# EasyEDA Pro project USB_HUB.epro

# Schematic Schematic1
Board Name: Board1; Create Date: 2026-03-28; Page Name: P1; Project Name: usb_hub; Schematic Name: Schematic1; Update Date: 2026-04-04; Company: EasyEDA.com; Page Size: A4; Version: V1.0
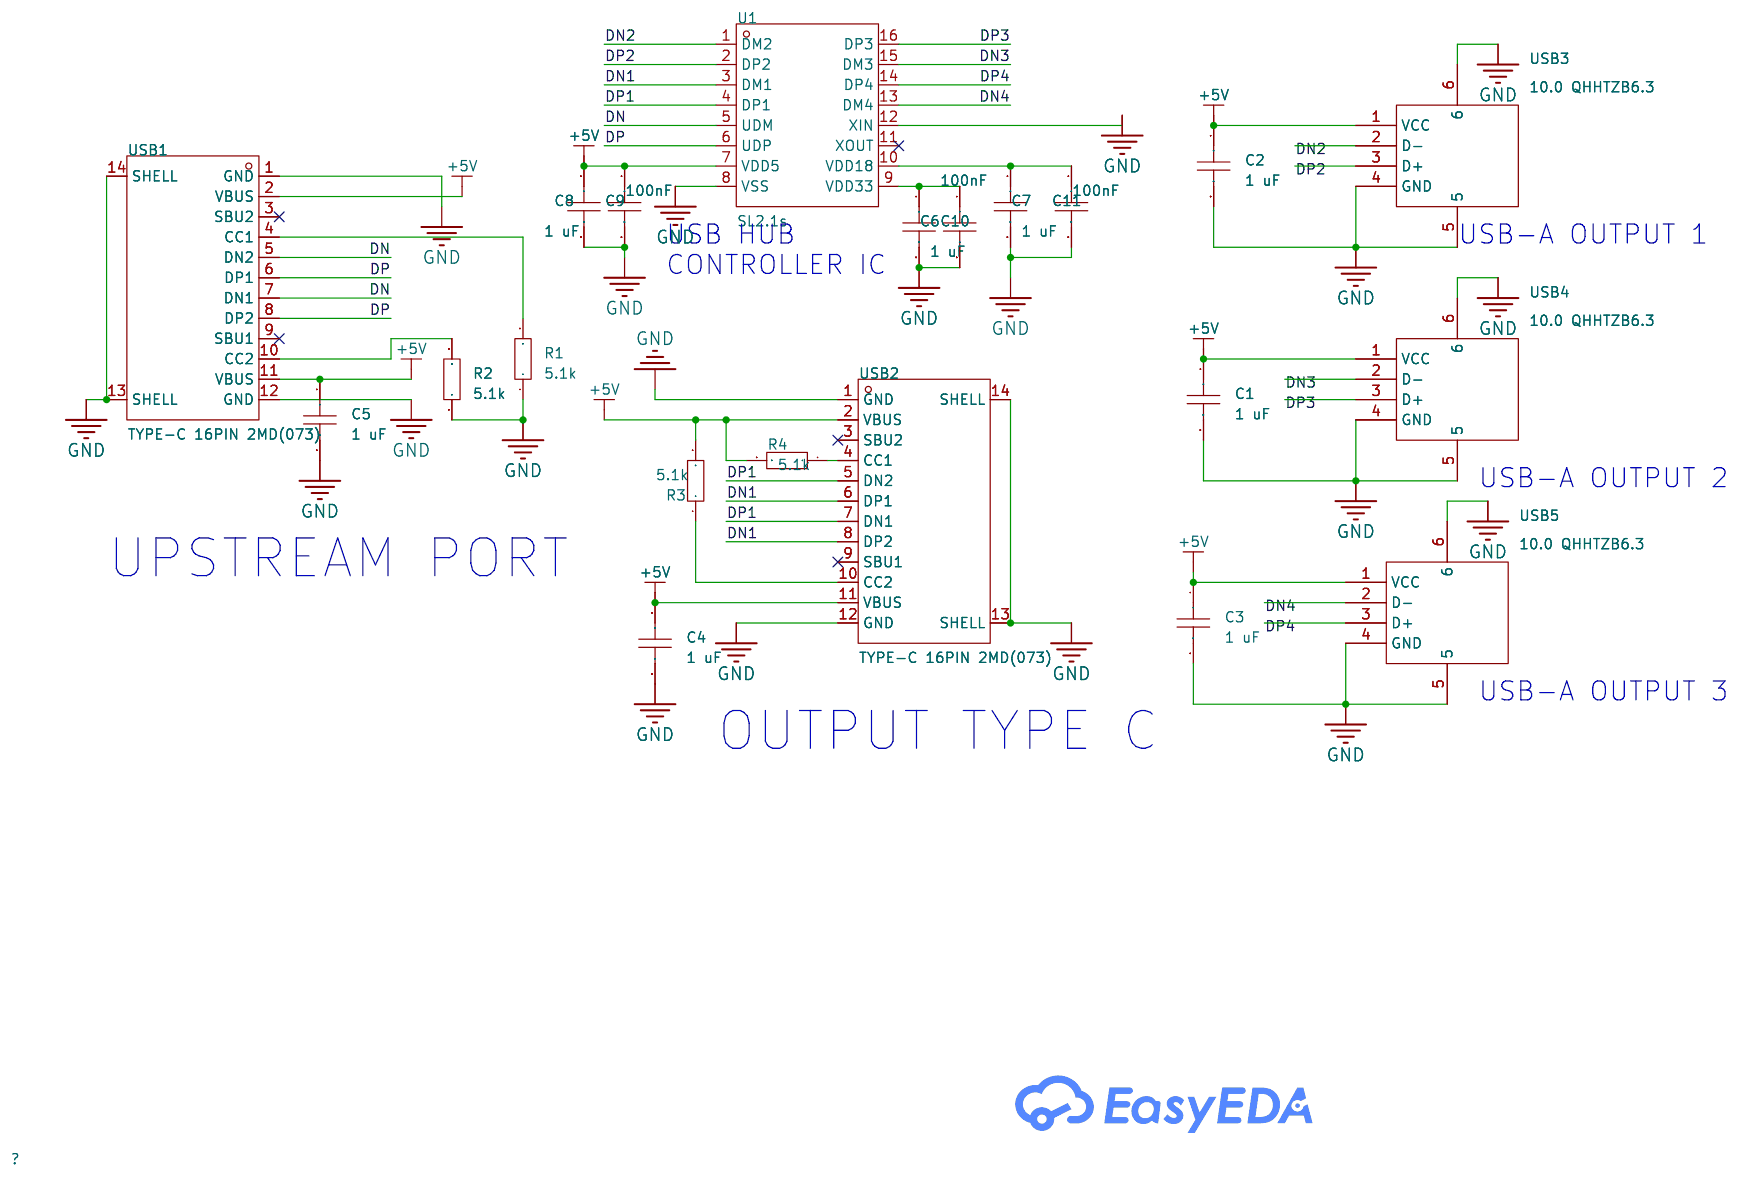
[diagram p0: schematic sheet]

## Parts
C1  1 uF  [C0603]
C2  1 uF  [C0603]
C3  1 uF  [C0603]
C4  1 uF  [C0603]
C5  1 uF  [C0603]
C6  1 uF  [C0603]
C7  1 uF  [C0603]
C8  1 uF  [C0603]
C9  100nF  [C0603]
C10  100nF  [C0603]
C11  100nF  [C0603]
R1  5.1k  [R0603]
R2  5.1k  [R0603]
R3  5.1k  [R0603]
R4  5.1k  [R0603]
U1  SL2.1s  [SSOP-16_L4.6-W2.6-P0.53-LS4.0-BL]
USB1  TYPE-C 16PIN 2MD(073)  [USB-C-SMD_TYPE-C-6PIN-2MD-073]
USB2  TYPE-C 16PIN 2MD(073)  [USB-C-SMD_TYPE-C-6PIN-2MD-073]
USB3  10.0 QHHTZB6.3  [USB-A-TH_10.0QHHTZB6.3]
USB4  10.0 QHHTZB6.3  [USB-A-TH_10.0QHHTZB6.3]
USB5  10.0 QHHTZB6.3  [USB-A-TH_10.0QHHTZB6.3]

## Library data of the parts
C1-C11 = CAP_0603: Supplier Footprint: 0603
R1-R4 = Res_0603: Supplier Footprint: 0603
U1 = SL2.1s: type:Hub USB Protocol:USB 2.0 Voltage - Supply:4V~5.25V Voltage - Supply:4V~5.25V Operating Temperature:0℃~+70℃ Operating Temperature:0℃~+70℃ Current - Supply:120mA Quiescent Supply Current:2.5mA Number of Channels:4; LCSC Part Name: USB2.0 HUB控制器集成电路; Supplier Part: C2684433; Manufacturer: CoreChips(和芯润德); Supplier Footprint: SSOP-16; JLCPCB Part Class: Extended Part; Datasheet: https://item.szlcsc.com/datasheet/SL2.1s/2782346.html; Supplier: LCSC; type: Hub; USB Protocol: USB 2.0; Voltage - Supply: 4V~5.25V; Operating Temperature: 0℃~+70℃; Current - Supply: 120mA; Quiescent Supply Current: 2.5mA; Number of Channels: 4
USB1 USB2 = TYPE-C 16PIN 2MD(073): Connector Type:Type-C Protocol Standard:- Gender:Female Mounting Type:Surface Mount, Right Angle Number of Contacts:16P Number of Ports:1 Current Rating-Power:3A Voltage Rating:5V Connect-Disconnect Life:10,000 Cycles Supplementary Features:- Center Heigh; LCSC Part Name: Type-C 母 卧贴; Supplier Part: C2765186; Manufacturer: SHOU HAN(首韩); Supplier Footprint: SMD; JLCPCB Part Class: Extended Part; Datasheet: https://item.szlcsc.com/datasheet/TYPE-C%252016PIN%25202MD(073)/2901843.html; Supplier: LCSC; Connector Type: Type-C; Gender: Female; Mounting Type: Surface Mount, Right Angle; Number of Contacts: 16P; Number of Ports: 1; Current Rating-Power: 3A; Voltage Rating: 5V; Connect-Disconnect Life: 10,000 Cycles; Detection color: Black; Operating Temperature: -25℃~+85℃
USB3-USB5 = 10.0 QHHTZB6.3: Connector Type:Type-A Protocol Standard:USB 2.0 Gender:Female Mounting Type:Surface Mount, Right Angle Number of Contacts:4P Number of Ports:1 Current Rating-Power:1.5A Voltage Rating:30V Connect-Disconnect Life:5,000 times Supplementary Features:- Center; LCSC Part Name: 壳长10.0mm; Supplier Part: C668591; Manufacturer: SHOU HAN(首韩); Supplier Footprint: SMD; JLCPCB Part Class: Extended Part; Datasheet: https://item.szlcsc.com/datasheet/10.0%2520QHHTZB6.3/698534.html; Supplier: LCSC; Connector Type: Type-A; Protocol Standard: USB 2.0; Gender: Female; Mounting Type: Surface Mount, Right Angle; Number of Contacts: 4P; Number of Ports: 1; Current Rating-Power: 1.5A; Voltage Rating: 30V; Connect-Disconnect Life: 5,000 times; Length: 10mm; Detection color: Black; Operating Temperature: -25℃~+85℃

## Nets
+5V: C1.1 C2.1 C3.1 C4.1 C5.1 C8.1 C9.1 R3.2 R4.2 U1.7(VDD5) USB1.2(VBUS) USB1.11(VBUS) USB2.2(VBUS) USB2.11(VBUS) USB3.1(VCC) USB4.1(VCC) USB5.1(VCC)
GND: C1.2 C2.2 C3.2 C4.2 C5.2 C6.2 C7.2 C8.2 C9.2 C10.2 C11.2 R1.1 R2.1 U1.8(VSS) U1.12(XIN) USB1.1(GND) USB1.12(GND) USB1.13(SHELL) USB1.14(SHELL) USB2.1(GND) USB2.12(GND) USB2.13(SHELL) USB2.14(SHELL) USB3.4(GND) USB3.5 USB3.6 USB4.4(GND) USB4.5 USB4.6 USB5.4(GND) USB5.5 USB5.6
DN: U1.5(UDM) USB1.5(DN2) USB1.7(DN1)
DN1: U1.3(DM1) USB2.6(DP1) USB2.8(DP2)
DN2: U1.1(DM2) USB3.2(D-)
DN3: U1.15(DM3) USB4.2(D-)
DN4: U1.13(DM4) USB5.2(D-)
DP: U1.6(UDP) USB1.6(DP1) USB1.8(DP2)
DP1: U1.4(DP1) USB2.5(DN2) USB2.7(DN1)
DP2: U1.2(DP2) USB3.3(D+)
DP3: U1.16(DP3) USB4.3(D+)
DP4: U1.14(DP4) USB5.3(D+)
$1N843: R2.2 USB1.10(CC2)
$1N849: R1.2 USB1.4(CC1)
$1N1535: R3.1 USB2.10(CC2)
$1N1585: R4.1 USB2.4(CC1)
$1N1869: C6.1 C10.1 U1.9(VDD33)
$1N1897: C7.1 C11.1 U1.10(VDD18)

Not connected (* = marked no-connect by the designer): U1 11(XOUT)*; USB1 3(SBU2)* 9(SBU1)*; USB2 3(SBU2)* 9(SBU1)*

## Notes on the sheet
- USB-A OUTPUT 1
- USB HUB
  CONTROLLER IC
- USB-A OUTPUT 2
- UPSTREAM PORT
- USB-A OUTPUT 3
- OUTPUT TYPE C

# Board PCB1
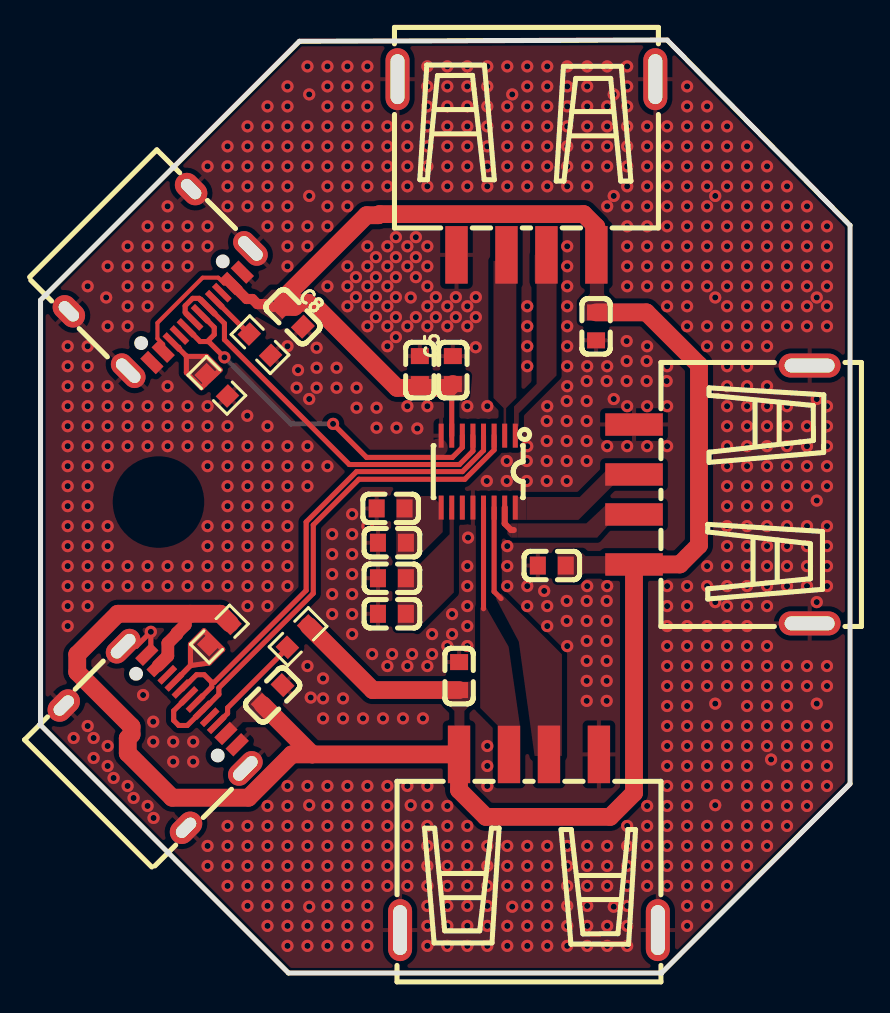
[diagram p1: board, top side]
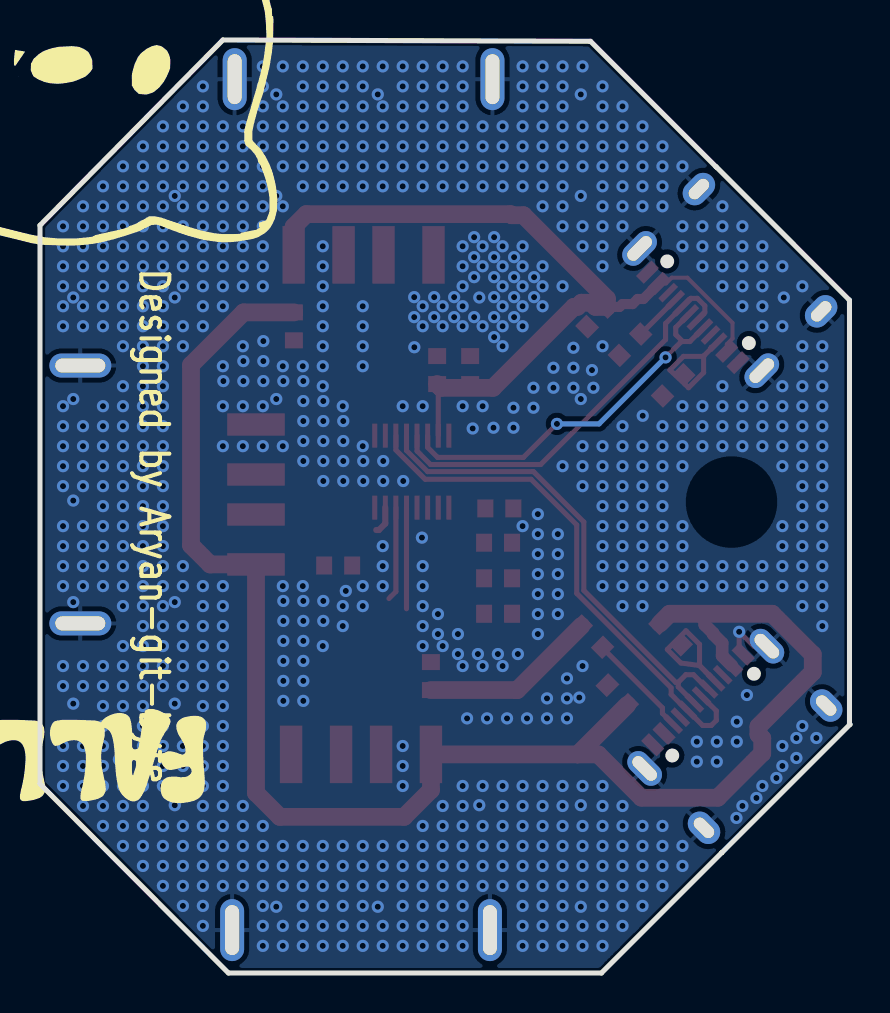
[diagram p2: board, bottom side, seen from below]

Outline 40.54 x 46.68 mm; copper layers: Top Layer, Bottom Layer. Coordinates in mm from the lower left corner of the outline.
Outline path: 0,12.44 6.41,6.02 6.42,6.02 12.44,0 31.11,0 40.54,9.46 40.54,37.4 31.38,46.68 12.99,46.61 6.7,40.33 6.69,40.33 0.03,33.66 0.03,12.47 0,12.44
Stack: Top Layer 0.035mm / Dielectric1 1.51mm FR4 er 4.5 / Bottom Layer 0.035mm

## Design rules (mm)
template: JLCPCB Capability(Two Layers Board)
spacing copperThickness1oz (default): track to track 0.102, other pairs 0.152 to 0.3
spacing copperThickness2oz: track to track 0.203, other pairs 0.152 to 0.3
track width copperThickness1oz (default): min 0.127, default 0.254, max 2.54
track width copperThickness2oz: min 0.203, default 0.254, max 2.54
differential pair differentialPair (default): width min 0.127, default 0.254, max 2.54; gap min 0.152, default 0.152
via viaSize (default): diameter min 0.5, default 0.61, max 10; hole min 0.3, default 0.305, max 6.3

## Placement (name value [footprint] x y rotation side)
C1  1 uF  [C0603]  20.97 14.86 90 top
C2  1 uF  [C0603]  27.83 32.35 270 top
C3  1 uF  [C0603]  25.62 20.39 180 top
C4  1 uF  [C0603]  11.65 13.91 45 top
C5  1 uF  [C0603]  19.01 30.16 90 top
C6  1 uF  [C0603]  17.55 23.24 180 top
C7  1 uF  [C0603]  17.61 19.75 180 top
C8  1 uF  [C0603]  12.66 32.83 315 top
C9  100nF  [C0603]  20.66 30.16 90 top
C10  100nF  [C0603]  17.61 21.53 180 top
C11  100nF  [C0603]  17.61 17.97 180 top
R1  5.1k  [R0603]  11.01 31.43 135 top
R2  5.1k  [R0603]  8.85 29.4 135 top
R3  5.1k  [R0603]  12.91 16.83 45 top
R4  5.1k  [R0603]  8.98 16.96 45 top
U1  SL2.1s  [SSOP-16_L4.6-W2.6-P0.53-LS4.0-BL]  21.93 25.08 180 top
USB1  TYPE-C 16PIN 2MD(073)  [USB-C-SMD_TYPE-C-6PIN-2MD-073]  6.18 34.48 225 top
USB2  TYPE-C 16PIN 2MD(073)  [USB-C-SMD_TYPE-C-6PIN-2MD-073]  5.93 12 315 top
USB3  10.0 QHHTZB6.3  [USB-A-TH_10.0QHHTZB6.3]  24.34 40.32 180 top
USB4  10.0 QHHTZB6.3  [USB-A-TH_10.0QHHTZB6.3]  34.12 23.94 90 top
USB5  10.0 QHHTZB6.3  [USB-A-TH_10.0QHHTZB6.3]  24.47 6.54 0 top

## Footprints (pads in the part's own frame, mm; a bottom-side part is the same pattern mirrored in y, then rotated)
C0603
  rect 0.8x0.9 smd: 1(-0.7,0) 2(0.7,0)
R0603
  rect 0.806x0.864 smd: 1(-0.753,0) 2(0.753,0)
SSOP-16_L4.6-W2.6-P0.53-LS4.0-BL
  rect 0.25x1.2 smd: 1(-1.855,-1.8) 2(-1.325,-1.8) 3(-0.795,-1.8) 4(-0.265,-1.8) 5(0.265,-1.8) 6(0.795,-1.8) 7(1.325,-1.8) 8(1.855,-1.8) 9(1.855,1.8) 10(1.325,1.8) 11(0.795,1.8) 12(0.265,1.8) 13(-0.265,1.8) 14(-0.795,1.8) 15(-1.325,1.8) 16(-1.855,1.8)
USB-A-TH_10.0QHHTZB6.3
  rect 1.12x2.88 smd: 1(-3.5,4.395) 2(-1,4.395) 3(1,4.395) 4(3.5,4.395)
  oval 1.2x3.1 hole 0.7x2.5: 5(-6.45,-4.395) 6(6.45,-4.395)
USB-C-SMD_TYPE-C-6PIN-2MD-073
  rect 0.55x1.1 smd: 1(-3.2,2.375) 2(-2.4,2.375) 11(2.4,2.375) 12(3.2,2.375)
  rect 0.3x1.1 smd: 3(-1.75,2.375) 4(-1.25,2.375) 5(-0.75,2.375) 6(-0.25,2.375) 7(0.25,2.375) 8(0.75,2.375) 9(1.25,2.375) 10(1.75,2.375)
  oval 1.1x2 hole 0.6x1.5: 13(-4.325,1.825) 14(4.325,1.825)
  oval 1.2x1.8 hole 0.6x1.2: 13(-4.325,-2.375) 14(4.325,-2.375)

## Nets
As in the schematic.

Pads without a net: U1 11; USB1 3 9; USB2 3 9

## Via types
v1: diameter 0.61, hole 0.305, Top Layer to Bottom Layer, 927 vias

## Routing (per net, layer and track width the routed paths; a pad name or vN(x,y) marks a point on that pad's centre or on a via; arc(x,y) is an arc through that point)
+5V: length 132.6
  Top Layer w0.2: USB1.2 9.21,34.5 8.92,34.79 8.14,34.79 5.88,32.53 5.88,31.74 6.17,31.46 6.17,31.11
  Top Layer w0.254: U1.7 20.61,29.41
  Top Layer w0.508: 12.17,33.33 11.53,33.33 11.39,33.47 10.88,33.47 10.63,33.72 10.34,33.72 USB1.2
  Top Layer w0.635: USB2.2 6.4,15.87 6.4,16.5 6.85,16.95 6.85,17 7.27,17.42 7.27,17.72 7.53,17.97
  Top Layer w0.889: C1.1 16.65,14.16 R3.2 ; R4.2 9.03,17.97 3.9,17.97 1.87,15.94 1.87,15.05 4.58,12.33 4.58,11.93 4.39,11.74 4.39,10.99 6.62,8.77 10.44,8.77 12.6,10.94 13.63,10.94 ; 13.63,10.94 USB5.1 20.97,9.15 22.31,7.81 28.54,7.81 29.73,9.01 USB4.1 32.02,20.44 32.98,21.4 32.98,30.42 30.35,33.05 C2.1 ; 13.63,10.94 11.15,13.41 ; C9.1 20.47,29.28 17.87,29.28 13.82,33.33 13.65,33.33 13.44,33.53 12.94,33.53 12.74,33.33 12.17,33.33 12.17,33.73 16.34,37.91 16.93,37.91 16.99,37.97 27.21,37.97 27.84,37.33 USB3.1
GND: length 2.9
  Top Layer w0.254: 5.35,15.95 5.43,15.95 5.55,16.07 v1(5.55,17.07) 4.83,16.35 USB2.13
  vias: v1(1.39,31.36) v1(1.39,30.36) v1(1.39,29.36) v1(1.39,28.36) v1(1.39,27.36) v1(1.39,26.36) v1(1.39,25.36) v1(1.39,24.36) v1(1.39,23.36) v1(1.39,22.36) v1(1.39,21.36) v1(1.39,20.36) v1(1.39,19.36) v1(1.39,18.36) v1(1.39,17.36) v1(1.69,11.76) v1(2.39,34.36) v1(2.39,31.36) v1(2.39,30.36) v1(2.39,29.36) v1(2.39,28.36) v1(2.39,27.36) v1(2.39,26.36) v1(2.39,25.36) v1(2.39,24.36) v1(2.39,23.36) v1(2.39,22.36) v1(2.39,21.36) v1(2.39,20.36) v1(2.39,19.36) v1(2.39,18.36) v1(2.39,12.36) v1(2.69,11.76) v1(2.69,10.76) v1(3.31,33.8) v1(3.39,35.36) v1(3.39,32.36) v1(3.39,29.36) v1(3.39,28.36) v1(3.39,27.36) v1(3.39,26.36) v1(3.39,25.36) v1(3.39,22.36) v1(3.39,21.36) v1(3.39,20.36) v1(3.39,19.36) v1(3.39,11.36) v1(3.39,10.36) v1(3.69,9.76) v1(4.39,36.36) v1(4.39,35.36) v1(4.39,34.36) v1(4.39,33.36) v1(4.39,32.36) v1(4.39,28.36) v1(4.39,27.36) v1(4.39,26.36) v1(4.39,20.36) v1(4.39,19.36) v1(4.39,9.36) v1(4.69,8.76) v1(5.16,13.91) v1(5.39,37.36) v1(5.39,36.36) v1(5.39,35.36) v1(5.39,34.36) v1(5.39,33.36) v1(5.39,28.36) v1(5.39,27.36) v1(5.39,26.36) v1(5.39,20.36) v1(5.39,19.36) v1(5.39,8.36) v1(5.67,12.57) v1(5.67,11.57) v1(5.69,7.76) v1(6.39,38.36) v1(6.39,37.36) v1(6.39,36.36) v1(6.39,35.36) v1(6.39,34.36) v1(6.39,29.36) v1(6.39,28.36) v1(6.39,27.36) v1(6.39,26.36) v1(6.39,20.36) v1(6.39,19.36) v1(6.67,11.57) v1(6.67,10.57) v1(7.39,37.36) v1(7.39,36.36) v1(7.39,35.36) v1(7.39,28.36) v1(7.39,27.36) v1(7.39,26.36) v1(7.39,20.36) v1(7.39,19.36) v1(7.67,11.57) v1(7.67,10.57) v1(8.39,40.36) v1(8.39,37.36) v1(8.39,36.36) v1(8.39,28.36) v1(8.39,27.36) v1(8.39,26.36) v1(8.39,25.36) v1(8.39,22.36) v1(8.39,21.36) v1(8.39,20.36) v1(8.39,19.36) v1(8.39,6.36) v1(8.39,5.36) v1(9.39,41.36) v1(9.39,40.36) v1(9.39,39.36) v1(9.39,38.36) v1(9.39,27.36) v1(9.39,26.36) v1(9.39,25.36) v1(9.39,24.36) v1(9.39,23.36) v1(9.39,22.36) v1(9.39,21.36) v1(9.39,20.36) v1(9.39,19.36) v1(9.39,7.36) v1(9.39,6.36) v1(9.39,5.36) v1(9.39,4.36) v1(10.39,42.36) v1(10.39,41.36) v1(10.39,40.36) v1(10.39,39.36) v1(10.39,38.36) v1(10.38,27.88) v1(10.39,26.36) v1(10.39,25.36) v1(10.39,24.36) v1(10.39,23.36) v1(10.39,22.36) v1(10.39,21.36) v1(10.39,20.36) v1(10.39,19.36) v1(10.39,18.36) v1(10.39,7.36) v1(10.39,6.36) v1(10.39,5.36) v1(10.39,4.36) v1(10.39,3.36) v1(11.39,43.36) v1(11.39,42.36) v1(11.39,41.36) v1(11.39,40.36) v1(11.39,39.36) v1(11.39,38.36) v1(11.39,37.36) v1(11.39,27.36) v1(11.39,26.36) v1(11.39,25.36) v1(11.39,24.36) v1(11.39,23.36) v1(11.39,22.36) v1(11.39,21.36) v1(11.39,20.36) v1(11.39,19.36) v1(11.39,18.36) v1(11.39,8.36) v1(11.39,7.36) v1(11.39,6.36) v1(11.39,5.36) v1(11.39,4.36) v1(11.39,3.36) v1(11.39,2.36) v1(12.39,44.36) v1(12.39,43.36) v1(12.39,42.36) v1(12.39,41.36) v1(12.39,40.36) v1(12.39,39.36) v1(12.39,38.36) v1(12.39,37.36) v1(12.39,36.36) v1(12.39,35.36) v1(12.39,31.36) v1(12.39,26.36) v1(12.39,25.36) v1(12.39,24.36) v1(12.39,23.36) v1(12.39,22.36) v1(12.39,21.36) v1(12.39,20.36) v1(12.39,19.36) v1(12.39,9.36) v1(12.39,8.36) v1(12.39,7.36) v1(12.39,6.36) v1(12.39,5.36) v1(12.39,4.36) v1(12.39,3.36) v1(12.39,2.36) v1(12.39,1.36) v1(12.84,29.28) v1(12.91,30.16) v1(13.39,45.36) v1(13.39,42.36) v1(13.39,41.36) v1(13.39,40.36) v1(13.39,37.36) v1(13.39,36.36) v1(13.39,26.36) v1(13.39,25.36) v1(13.39,24.36) v1(13.39,15.36) v1(13.39,9.36) v1(13.39,7.36) v1(13.39,6.36) v1(13.39,5.36) v1(13.39,4.36) v1(13.39,2.36) v1(13.39,1.36) v1(13.47,43.96) v1(13.47,38.88) v1(13.47,28.72) v1(13.55,13.78) v1(13.47,8.4) v1(13.47,3.32) v1(13.84,31.28) v1(13.84,30.28) v1(13.84,29.28) v1(14.17,14.74) v1(14.17,13.74) v1(14.17,12.74) v1(14.39,45.36) v1(14.39,44.36) v1(14.39,43.36) v1(14.39,42.36) v1(14.39,41.36) v1(14.39,40.36) v1(14.39,39.36) v1(14.39,38.36) v1(14.39,37.36) v1(14.39,34.36) v1(14.39,25.36) v1(14.39,9.36) v1(14.39,8.36) v1(14.39,7.36) v1(14.39,6.36) v1(14.39,5.36) v1(14.39,4.36) v1(14.39,3.36) v1(14.39,2.36) v1(14.39,1.36) v1(14.62,21.96) v1(14.62,20.96) v1(14.62,19.96) v1(14.62,18.96) v1(14.62,17.96) v1(14.84,30.28) v1(14.84,29.28) v1(15.17,13.74) v1(15.17,12.74) v1(15.39,45.36) v1(15.39,44.36) v1(15.39,43.36) v1(15.39,42.36) v1(15.39,41.36) v1(15.39,40.36) v1(15.39,39.36) v1(15.39,38.36) v1(15.39,35.36) v1(15.39,34.36) v1(15.39,33.36) v1(15.39,9.36) v1(15.39,8.36) v1(15.39,7.36) v1(15.39,6.36) v1(15.39,5.36) v1(15.39,4.36) v1(15.39,3.36) v1(15.39,2.36) v1(15.39,1.36) v1(15.62,22.96) v1(15.62,21.96) v1(15.62,20.96) v1(15.62,19.96) v1(15.62,18.96) v1(15.62,17.96) v1(15.62,16.96) v1(15.81,34.81) v1(15.81,33.81) v1(15.84,29.28) v1(15.84,28.28) v1(16.17,12.74) v1(16.39,45.36) v1(16.39,44.36) v1(16.39,43.36) v1(16.39,42.36) v1(16.39,41.36) v1(16.39,40.36) v1(16.39,39.36) v1(16.39,36.36) v1(16.39,35.36) v1(16.39,34.36) v1(16.39,33.36) v1(16.39,32.36) v1(16.39,22.36) v1(16.39,9.36) v1(16.39,8.36) v1(16.39,7.36) v1(16.39,6.36) v1(16.39,5.36) v1(16.39,4.36) v1(16.39,3.36) v1(16.39,2.36) v1(16.39,1.36) v1(16.62,15.96) v1(16.81,35.81) v1(16.81,34.81) v1(16.81,33.81) v1(16.81,32.81) v1(16.84,28.28) v1(16.84,27.28) v1(17.17,12.74) v1(17.39,42.36) v1(17.39,41.36) v1(17.39,40.36) v1(17.39,39.36) v1(17.39,36.36) v1(17.39,35.36) v1(17.39,34.36) v1(17.39,33.36) v1(17.39,32.36) v1(17.39,31.36) v1(17.39,15.36) v1(17.39,9.36) v1(17.39,8.36) v1(17.39,7.36) v1(17.39,6.36) v1(17.39,5.36) v1(17.39,4.36) v1(17.62,15.96) v1(17.81,36.81) v1(17.81,35.81) v1(17.81,34.81) v1(17.81,33.81) v1(17.81,32.81) v1(17.81,31.81) v1(17.84,27.28) v1(18.17,12.74) v1(18.39,42.36) v1(18.39,41.36) v1(18.39,40.36) v1(18.39,39.36) v1(18.39,36.36) v1(18.39,35.36) v1(18.39,32.36) v1(18.39,28.36) v1(18.39,15.36) v1(18.39,9.36) v1(18.39,7.36) v1(18.39,6.36) v1(18.39,5.36) v1(18.39,4.36) v1(18.55,33.8) v1(18.62,15.96) v1(18.55,8.4) v1(18.81,36.81) v1(18.81,35.81) v1(18.81,34.81) v1(18.81,32.81) v1(18.88,27.24) v1(19.17,12.74) v1(19.39,45.36) v1(19.39,44.36) v1(19.39,43.36) v1(19.39,42.36) v1(19.39,41.36) v1(19.39,40.36) v1(19.39,39.36) v1(19.39,36.36) v1(19.39,35.36) v1(19.39,34.36) v1(19.39,33.36) v1(19.39,32.36) v1(19.39,28.36) v1(19.39,15.36) v1(19.39,9.36) v1(19.39,8.36) v1(19.39,7.36) v1(19.39,6.36) v1(19.39,5.36) v1(19.39,4.36) v1(19.39,3.36) v1(19.39,2.36) v1(19.39,1.36) v1(19.62,16.96) v1(19.62,15.96) v1(19.81,33.81) v1(19.81,32.81) v1(20.39,45.36) v1(20.39,44.36) v1(20.39,43.36) v1(20.39,42.36) v1(20.39,41.36) v1(20.39,40.36) v1(20.39,39.36) v1(20.39,33.36) v1(20.39,32.36) v1(20.39,16.36) v1(20.39,8.36) v1(20.39,7.36) v1(20.39,6.36) v1(20.39,5.36) v1(20.39,4.36) v1(20.39,3.36) v1(20.39,2.36) v1(20.39,1.36) v1(20.62,17.96) v1(20.62,16.96) v1(20.81,33.81) v1(20.81,32.81) v1(21.39,45.36) v1(21.39,44.36) v1(21.39,43.36) v1(21.39,42.36) v1(21.39,41.36) v1(21.39,40.36) v1(21.39,39.36) v1(21.39,33.36) v1(21.39,32.36) v1(21.39,28.36) v1(21.42,21.78) v1(21.39,20.36) v1(21.39,19.36) v1(21.39,18.36) v1(21.39,17.36) v1(21.39,16.36) v1(21.39,7.36) v1(21.39,6.36) v1(21.39,5.36) v1(21.39,4.36) v1(21.39,3.36) v1(21.39,2.36) v1(21.39,1.36) v1(21.81,33.81) v1(21.81,32.81) v1(21.81,31.31) v1(22.39,45.36) v1(22.39,44.36) v1(22.39,43.36) v1(22.39,42.36) v1(22.39,41.36) v1(22.39,40.36) v1(22.39,39.36) v1(22.39,28.36) v1(22.36,24.61) v1(22.39,11.36) v1(22.39,10.36) v1(22.39,9.36) v1(22.39,6.36) v1(22.39,5.36) v1(22.39,4.36) v1(22.39,3.36) v1(22.39,2.36) v1(22.39,1.36) v1(23.39,45.36) v1(23.39,43.36) v1(23.39,42.36) v1(23.39,41.36) v1(23.39,40.36) v1(23.39,39.36) v1(23.36,25.61) v1(23.36,24.61) v1(23.39,21.36) v1(23.39,20.36) v1(23.39,19.36) v1(23.39,6.36) v1(23.39,5.36) v1(23.39,4.36) v1(23.39,2.36) v1(23.39,1.36) v1(23.63,43.96) v1(23.63,3.32) v1(24.39,45.36) v1(24.39,44.36) v1(24.39,43.36) v1(24.39,42.36) v1(24.39,41.36) v1(24.39,40.36) v1(24.39,39.36) v1(24.39,33.36) v1(24.39,32.36) v1(24.39,31.36) v1(24.39,30.36) v1(24.39,26.36) v1(24.36,25.61) v1(24.36,24.61) v1(24.39,19.36) v1(24.39,18.36) v1(24.39,6.36) v1(24.39,5.36) v1(24.39,4.36) v1(24.39,3.36) v1(24.39,2.36) v1(24.39,1.36) v1(25.23,19.12) v1(25.39,45.36) v1(25.39,44.36) v1(25.39,43.36) v1(25.39,42.36) v1(25.39,41.36) v1(25.39,40.36) v1(25.39,39.36) v1(25.39,28.36) v1(25.36,27.61) v1(25.36,26.61) v1(25.36,25.61) v1(25.36,24.61) v1(25.39,18.36) v1(25.39,17.36) v1(25.39,6.36) v1(25.39,5.36) v1(25.39,4.36) v1(25.39,3.36) v1(25.39,2.36) v1(25.39,1.36) v1(26.39,45.36) v1(26.39,44.36) v1(26.39,43.36) v1(26.39,42.36) v1(26.39,41.36) v1(26.39,40.36) v1(26.39,39.36) v1(26.39,36.36) v1(26.39,35.36) v1(26.39,34.36) v1(26.39,33.36) v1(26.39,32.36) v1(26.39,31.36) v1(26.39,30.36) v1(26.39,29.36) v1(26.36,28.61) v1(26.36,27.61) v1(26.36,26.61) v1(26.36,25.61) v1(26.36,24.61) v1(26.36,18.61) v1(26.36,17.61) v1(26.39,16.36) v1(26.39,6.36) v1(26.39,5.36) v1(26.39,4.36) v1(26.39,3.36) v1(26.39,2.36) v1(26.39,1.36) v1(27.39,45.36) v1(27.39,44.36) v1(27.39,43.36) v1(27.39,42.36) v1(27.39,41.36) v1(27.39,40.36) v1(27.39,39.36) v1(27.39,30.36) v1(27.36,29.61) v1(27.36,28.61) v1(27.36,27.61) v1(27.36,26.61) v1(27.36,25.61) v1(27.39,19.36) v1(27.36,18.61) v1(27.36,17.61) v1(27.36,16.61) v1(27.36,15.61) v1(27.36,14.61) v1(27.36,13.61) v1(27.39,6.36) v1(27.39,5.36) v1(27.39,4.36) v1(27.39,3.36) v1(27.39,2.36) v1(27.39,1.36) v1(28.39,45.36) v1(28.39,43.36) v1(28.39,42.36) v1(28.39,41.36) v1(28.39,40.36) v1(28.39,38.36) v1(28.39,30.36) v1(28.36,29.61) v1(28.39,26.36) v1(28.39,19.36) v1(28.36,18.61) v1(28.36,17.61) v1(28.36,16.61) v1(28.36,15.61) v1(28.36,14.61) v1(28.36,13.61) v1(28.39,6.36) v1(28.39,5.36) v1(28.39,4.36) v1(28.39,2.36) v1(28.39,1.36) v1(28.71,43.96) v1(28.71,38.88) v1(28.71,28.72) v1(28.71,3.32) v1(29.39,45.36) v1(29.39,44.36) v1(29.39,43.36) v1(29.39,42.36) v1(29.39,41.36) v1(29.39,40.36) v1(29.39,39.36) v1(29.39,38.36) v1(29.39,37.36) v1(29.39,36.36) v1(29.39,35.36) v1(29.39,34.36) v1(29.36,31.61) v1(29.36,30.61) v1(29.36,29.61) v1(29.39,28.36) v1(29.39,26.36) v1(29.39,7.36) v1(29.39,6.36) v1(29.39,5.36) v1(29.39,4.36) v1(29.39,3.36) v1(29.39,2.36) v1(29.39,1.36) v1(30.39,42.36) v1(30.39,41.36) v1(30.39,40.36) v1(30.39,39.36) v1(30.39,38.36) v1(30.39,37.36) v1(30.39,36.36) v1(30.39,35.36) v1(30.39,34.36) v1(30.39,31.36) v1(30.36,30.61) v1(30.36,29.61) v1(30.39,28.36) v1(30.39,26.36) v1(30.39,8.36) v1(30.39,7.36) v1(30.39,6.36) v1(30.39,5.36) v1(30.39,4.36) v1(31.39,42.36) v1(31.39,41.36) v1(31.39,40.36) v1(31.39,39.36) v1(31.39,38.36) v1(31.39,37.36) v1(31.39,36.36) v1(31.39,35.36) v1(31.39,34.36) v1(31.39,33.36) v1(31.39,30.36) v1(31.36,29.61) v1(31.39,28.36) v1(31.39,26.36) v1(31.39,19.36) v1(31.39,18.36) v1(31.39,17.36) v1(31.39,16.36) v1(31.39,15.36) v1(31.39,14.36) v1(31.39,13.36) v1(31.39,12.36) v1(31.39,11.36) v1(31.39,10.36) v1(31.39,9.36) v1(31.39,8.36) v1(31.39,7.36) v1(31.39,6.36) v1(31.39,5.36) v1(31.39,4.36) v1(32.39,44.36) v1(32.39,43.36) v1(32.39,42.36) v1(32.39,41.36) v1(32.39,40.36) v1(32.39,39.36) v1(32.39,38.36) v1(32.39,37.36) v1(32.39,36.36) v1(32.39,35.36) v1(32.39,34.36) v1(32.39,33.36) v1(32.39,32.36) v1(32.39,19.36) v1(32.39,18.36) v1(32.39,17.36) v1(32.39,16.36) v1(32.39,15.36) v1(32.39,14.36) v1(32.39,13.36) v1(32.39,12.36) v1(32.39,11.36) v1(32.39,10.36) v1(32.39,9.36) v1(32.39,8.36) v1(32.39,7.36) v1(32.39,6.36) v1(32.39,5.36) v1(32.39,4.36) v1(32.39,3.36) v1(32.39,2.36) v1(33.39,43.36) v1(33.39,42.36) v1(33.39,41.36) v1(33.39,40.36) v1(33.39,39.36) v1(33.39,38.36) v1(33.39,37.36) v1(33.39,36.36) v1(33.39,35.36) v1(33.39,34.36) v1(33.39,32.36) v1(33.39,31.36) v1(33.39,20.36) v1(33.39,19.36) v1(33.39,17.36) v1(33.39,16.36) v1(33.39,15.36) v1(33.39,14.36) v1(33.39,12.36) v1(33.39,11.36) v1(33.39,10.36) v1(33.39,9.36) v1(33.39,7.36) v1(33.39,6.36) v1(33.39,5.36) v1(33.39,4.36) v1(33.39,3.36) v1(33.79,38.88) v1(33.79,33.8) v1(33.79,18.56) v1(33.79,13.48) v1(33.79,8.4) v1(34.39,42.36) v1(34.39,41.36) v1(34.39,40.36) v1(34.39,39.36) v1(34.39,38.36) v1(34.39,37.36) v1(34.39,36.36) v1(34.39,35.36) v1(34.39,34.36) v1(34.39,33.36) v1(34.39,32.36) v1(34.39,31.36) v1(34.39,30.36) v1(34.39,29.36) v1(34.39,28.36) v1(34.39,27.36) v1(34.39,26.36) v1(34.39,25.36) v1(34.39,24.36) v1(34.39,23.36) v1(34.39,22.36) v1(34.39,21.36) v1(34.39,20.36) v1(34.39,19.36) v1(34.39,18.36) v1(34.39,17.36) v1(34.39,16.36) v1(34.39,15.36) v1(34.39,14.36) v1(34.39,12.36) v1(34.39,11.36) v1(34.39,10.36) v1(34.39,9.36) v1(34.39,7.36) v1(34.39,6.36) v1(34.39,5.36) v1(34.39,4.36) v1(35.39,41.36) v1(35.39,40.36) v1(35.39,39.36) v1(35.39,38.36) v1(35.39,37.36) v1(35.39,36.36) v1(35.39,35.36) v1(35.39,34.36) v1(35.39,33.36) v1(35.39,32.36) v1(35.39,31.36) v1(35.39,30.36) v1(35.39,29.36) v1(35.39,28.36) v1(35.39,27.36) v1(35.39,26.36) v1(35.39,25.36) v1(35.39,24.36) v1(35.39,23.36) v1(35.39,22.36) v1(35.39,21.36) v1(35.39,20.36) v1(35.39,19.36) v1(35.39,18.36) v1(35.39,17.36) v1(35.39,16.36) v1(35.39,15.36) v1(35.39,14.36) v1(35.39,13.36) v1(35.39,12.36) v1(35.39,11.36) v1(35.39,10.36) v1(35.39,9.36) v1(35.39,8.36) v1(35.39,7.36) v1(35.39,6.36) v1(35.39,5.36) v1(36.39,40.36) v1(36.39,39.36) v1(36.39,38.36) v1(36.39,37.36) v1(36.39,36.36) v1(36.39,35.36) v1(36.39,34.36) v1(36.39,33.36) v1(36.39,32.36) v1(36.39,31.36) v1(36.39,29.36) v1(36.39,28.36) v1(36.39,27.36) v1(36.39,26.36) v1(36.39,25.36) v1(36.39,24.36) v1(36.39,23.36) v1(36.39,22.36) v1(36.39,21.36) v1(36.39,20.36) v1(36.39,19.36) v1(36.39,18.36) v1(36.39,16.36) v1(36.39,15.36) v1(36.39,14.36) v1(36.39,13.36) v1(36.39,12.36) v1(36.39,11.36) v1(36.39,9.36) v1(36.39,8.36) v1(36.39,7.36) v1(36.39,6.36) v1(36.59,10.68) v1(37.39,39.36) v1(37.39,38.36) v1(37.39,37.36) v1(37.39,36.36) v1(37.39,35.36) v1(37.39,34.36) v1(37.39,33.36) v1(37.39,32.36) v1(37.39,28.36) v1(37.39,27.36) v1(37.39,26.36) v1(37.39,25.36) v1(37.39,24.36) v1(37.39,23.36) v1(37.39,22.36) v1(37.39,21.36) v1(37.39,20.36) v1(37.39,19.36) v1(37.39,15.36) v1(37.39,14.36) v1(37.39,13.36) v1(37.39,12.36) v1(37.39,11.36) v1(37.39,10.36) v1(37.39,9.36) v1(37.39,8.36) v1(37.39,7.36) v1(38.39,38.36) v1(38.39,37.36) v1(38.39,36.36) v1(38.39,35.36) v1(38.39,34.36) v1(38.39,33.36) v1(38.39,32.36) v1(38.39,27.36) v1(38.39,26.36) v1(38.39,25.36) v1(38.39,24.36) v1(38.39,22.36) v1(38.39,21.36) v1(38.39,20.36) v1(38.39,19.36) v1(38.39,15.36) v1(38.39,14.36) v1(38.39,12.36) v1(38.39,11.36) v1(38.39,10.36) v1(38.39,9.36) v1(38.39,8.36) v1(38.87,33.8) v1(38.87,28.72) v1(38.87,23.64) v1(38.87,18.56) v1(38.87,13.48) v1(39.39,37.36) v1(39.39,36.36) v1(39.39,35.36) v1(39.39,34.36) v1(39.39,33.36) v1(39.39,32.36) v1(39.39,28.36) v1(39.39,27.36) v1(39.39,26.36) v1(39.39,25.36) v1(39.39,24.36) v1(39.39,22.36) v1(39.39,21.36) v1(39.39,20.36) v1(39.39,19.36) v1(39.39,15.36) v1(39.39,14.36) v1(39.39,12.36) v1(39.39,11.36) v1(39.39,10.36) v1(39.39,9.36)
DN: length 20.4
  Top Layer w0.254: U1.5 21.67,26.11 20.99,25.44 15.48,25.44 9.23,31.69 9.23,32.49 USB1.5 7.97,33.75 7.64,33.75 7.27,33.38 7.27,33.05 USB1.7
DN1: length 26.3
  Top Layer w0.254: U1.3 22.73,26.17 21.26,24.7 15.96,24.7 13.68,22.42 13.68,18.99 8.95,14.27 8.95,13.94 8.17,13.15 USB2.8 7.37,12.38 6.95,12.38 6.69,12.64 6.69,13.12 USB2.6
DN3: length 1.4
  Top Layer w0.305: U1.15 23.26,22.48 23.58,22.16 23.71,22.16
DN4: length 5.1
  Top Layer w0.254: U1.13 22.2,18.23
DP: length 19.1
  Top Layer w0.254: 8.37,31.59 8.72,31.94 8.72,32.3 USB1.6 ; 8.37,31.59 8.44,31.59 v1(9.23,30.8) ; 8.37,31.59 8.01,31.59 USB1.8 ; U1.6 21.14,26.29 20.64,25.8 16.34,25.8 v1(14.67,27.47)
  Bottom Layer w0.254: v1(14.67,27.47) 12.56,27.47 v1(9.23,30.8)
DP1: length 24.5
  Top Layer w0.254: 8.6,14.54 8.22,14.92 7.84,14.92 7.12,14.21 USB2.5 ; 8.6,14.54 8.72,14.54 13.32,19.14 13.32,22.56 15.84,25.08 21.14,25.08 22.2,26.14 U1.4 ; 8.6,14.54 8.6,14.32 7.79,13.51
DP4: length 4.7
  Top Layer w0.254: 23.08,18.73 22.73,19.08 U1.14
$1N849: length 2.4
  Top Layer w0.254: USB1.4 10.47,31.97 R1.2
$1N1535: length 5.3
  Top Layer w0.254: R3.1 12.38,16.26 9.39,13.27 9.39,12.99 USB2.10
$1N843: length 5.8
  Top Layer w0.254: 6.95,31.31 6.95,31.25 7.33,30.86 ; 7.33,30.86 7.33,30.85 ; 7.33,30.86 7.33,30.85 ; 7.33,30.85 7.33,30.04 8.08,29.28 8.26,29.46 9.02,30.17 8.34,30.85 7.33,30.85
$1N1585: length 7.5
  Top Layer w0.254: 7.53,15.38 USB2.4 7.53,15.38 ; 7.53,15.38 7.53,16.44 8.21,17.12 9.14,16.19 8.47,15.51 7.53,15.38 ; 7.53,15.38 7.53,15.37

## Copper pours and planes (outline as drawn; the poured copper is in the pictures)
+5V on Top Layer: 9.31,14.21 11.95,14.21 11.95,11.99 9.31,11.99
+5V on Top Layer: 27.12,35.52 28.54,35.52 28.54,32.63 27.12,32.63
+5V on Top Layer: 18.3,29.88 21.37,29.88 21.37,28.87 18.3,28.87
+5V on Top Layer: 25.9,21.02 28.79,21.02 28.79,19.68 25.9,19.68
+5V on Top Layer: 10.73,34.19 12.97,34.19 12.97,32.45 10.73,32.45
+5V on Top Layer: 20.27,14.58 21.68,14.58 21.68,11.35 20.27,11.35
GND on Top Layer: -4.99,48.58 55.59,48.58 58,46.17 58,-9.97 56.09,-11.87 -5.63,-11.87 -7.79,-9.71 -4.99,-6.92
GND on Top Layer: 4.28,17.34 5.79,17.34 6.06,17.07 6.06,16.71 5.93,16.58 5.93,15.94 5.68,15.69 5.37,15.69 5.08,15.4 4.66,15.81 4.41,15.81 3.87,16.35 3.8,16.35 3.8,16.86
GND on Bottom Layer: -5.5,48.71 43.14,48.71 49.75,42.1 49.75,-5.14 -0.93,-5.14 -5.5,-0.57
DN2 on Top Layer: 23.72,35.93 25.85,35.93 25.85,27.24 23.72,27.24
DN3 on Top Layer: 23.91,23.5 28.42,23.5 28.42,21.78 23.91,21.78
DN4 on Top Layer: 22.03,18.28 24.02,18.28 24.02,12.38 22.03,12.38
DP2 on Top Layer: 22.69,35.63 23.84,35.63 23.84,26.99 22.69,26.99
DP3 on Top Layer: 24.34,25.47 28.66,25.47 28.66,22.67 24.34,22.67
DP4 on Top Layer: 22.82,18.99 26.12,18.99 26.12,10.86 22.82,10.86
$1N843 on Top Layer: 7.33,30.85 9.02,30.85 9.02,29.28 7.33,29.28
$1N1585 on Top Layer: 7.53,17.12 9.14,17.12 9.14,15.38 7.53,15.38
$1N1869 on Top Layer: 17.83,23.95 20.15,23.95 20.15,20.82 17.83,20.82
$1N1897 on Top Layer: 17.89,23.28 20.71,23.28 20.71,17.21 17.89,17.21

Small or netless copper shapes (teardrops, artwork), in the pictures only: 4 on Top Layer

## Text on the board
Bottom Silkscreen Layer: Designed by Aryan-git-byte
